# EasyEDA Pro project PM_proj.eprj

# Schematic Proiect

## Sheets
1 Unitate Centrala: Board Name: Board1; Create Date: 2025-11-04; Page Name: Unitate Centrala; Project Name: PM_proj; Schematic Name: Proiect; Update Date: 2025-11-04; Company: EasyEDA.com; Page Size: A4; Version: V1.0
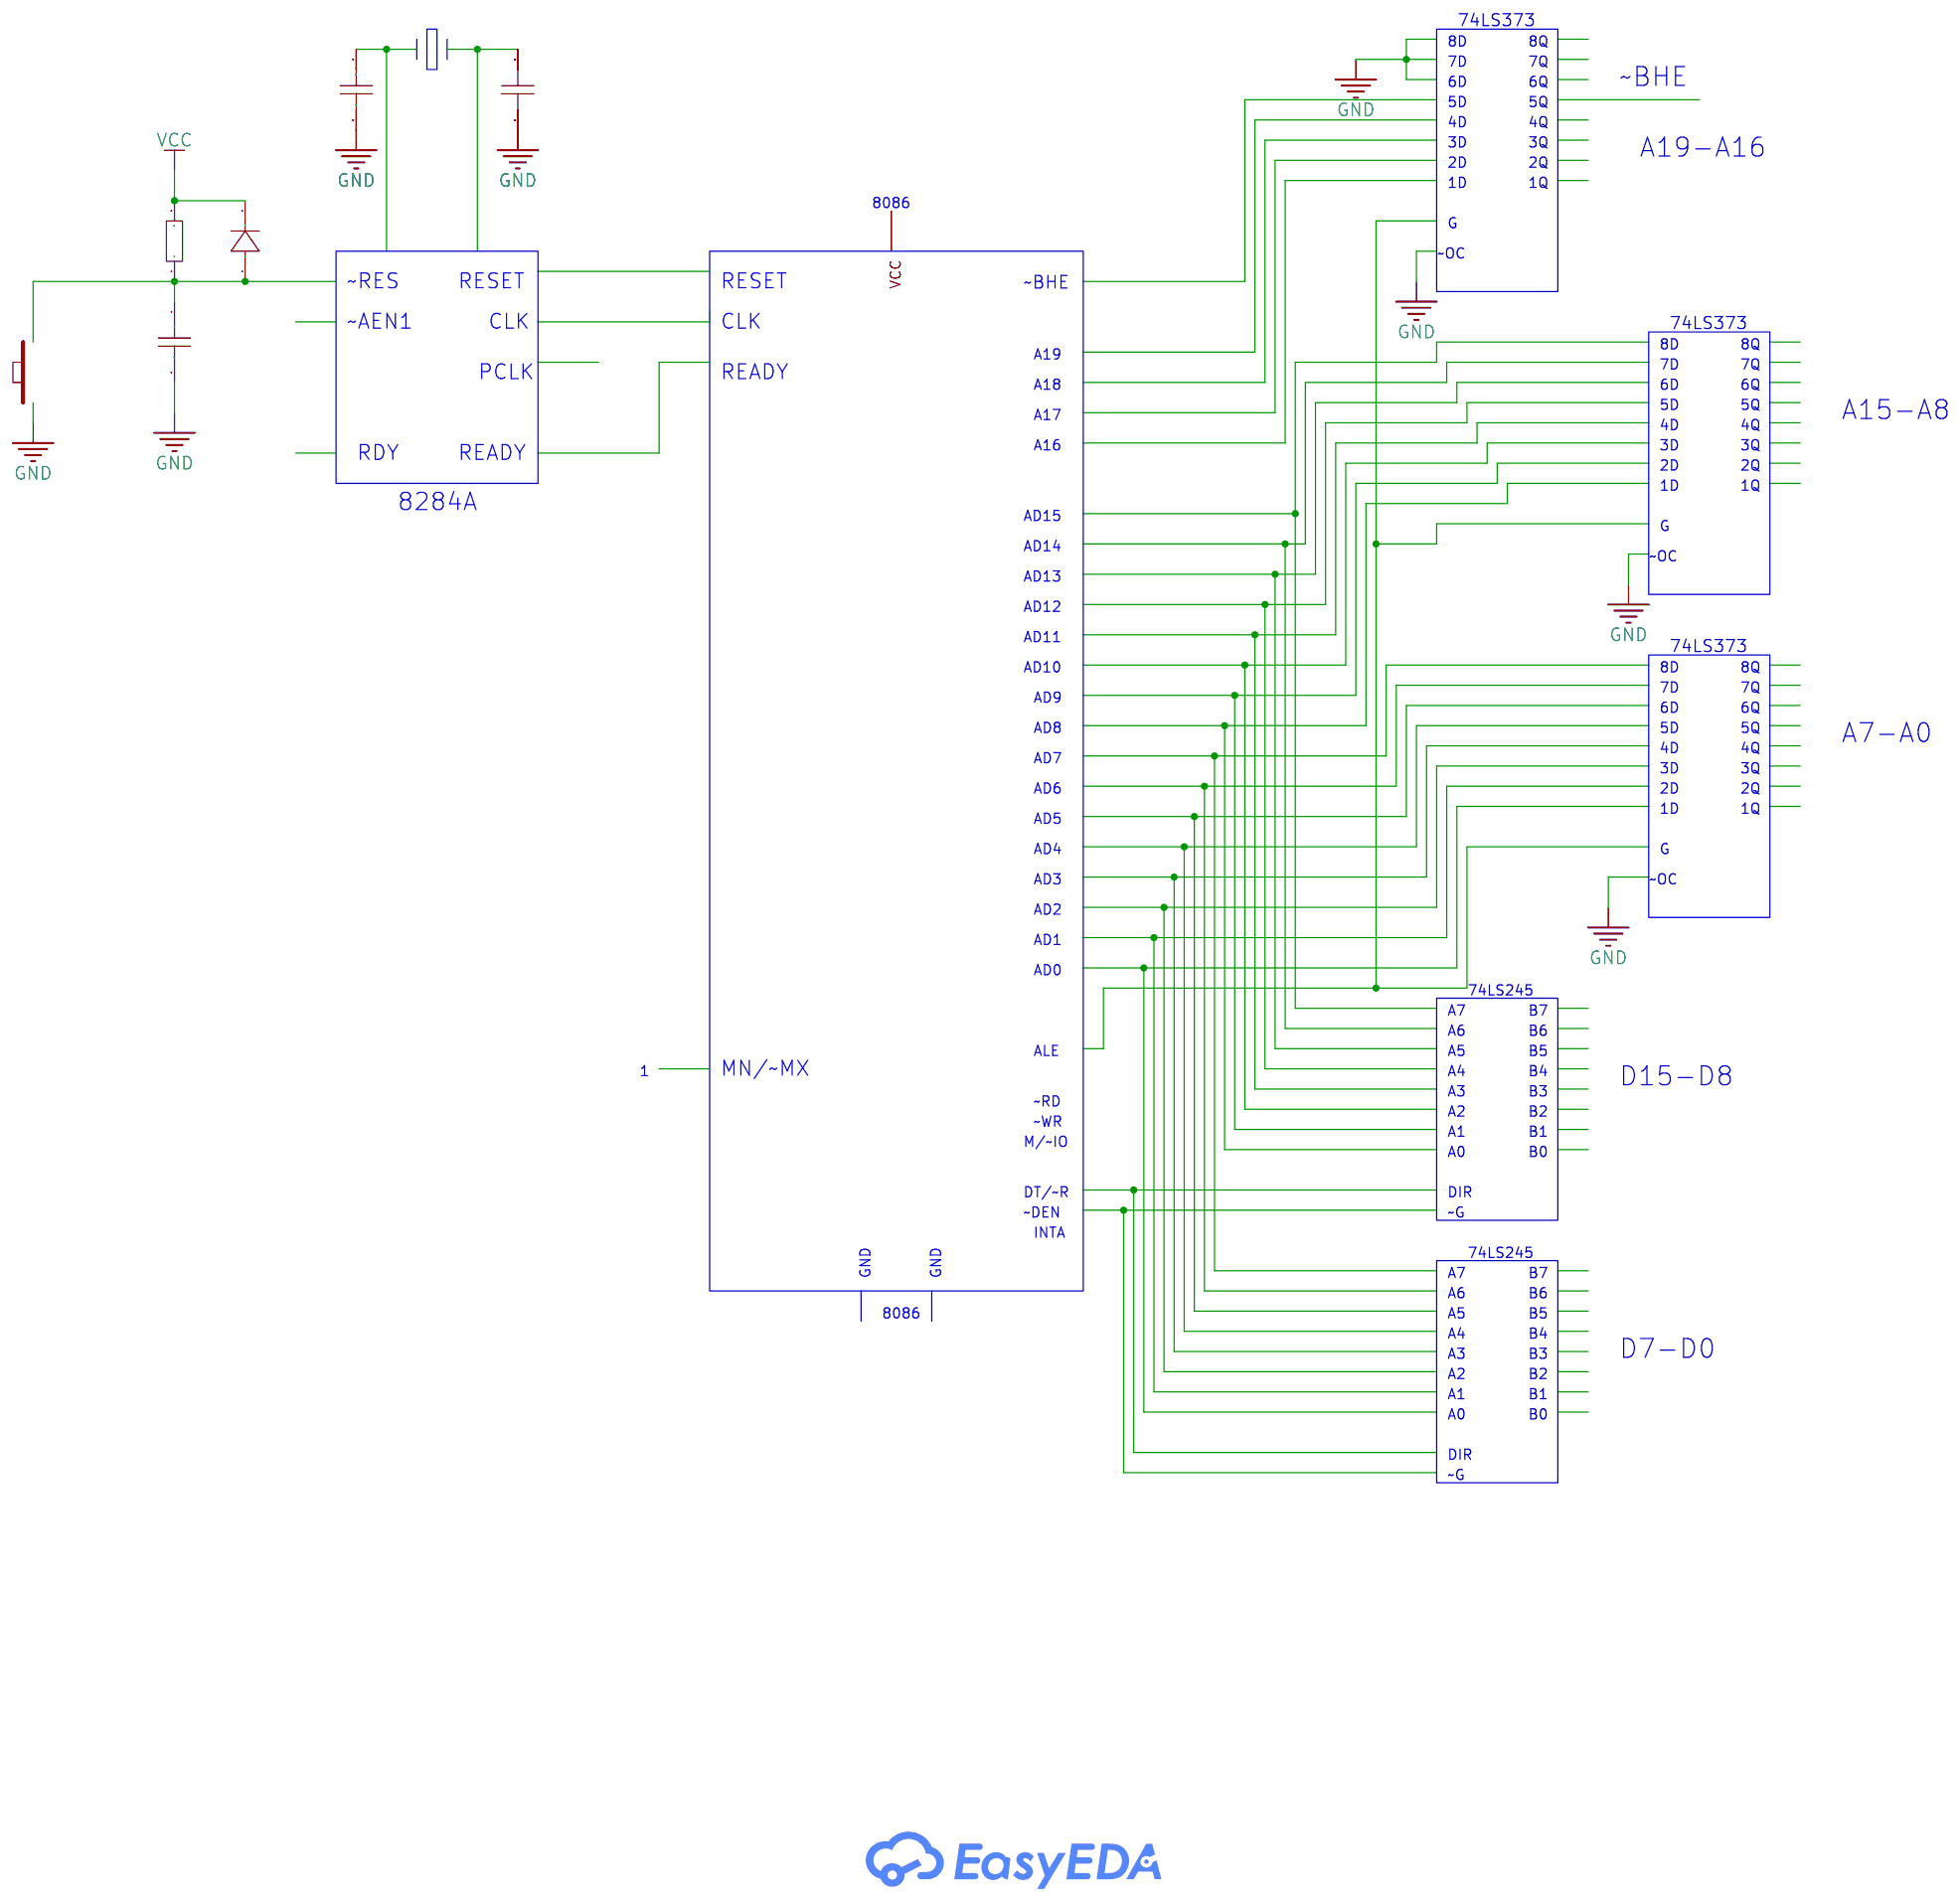
[diagram p0: Unitate Centrala]
2 2. Conectarea Mem: Create Date: 2025-11-11; Page Name: 2. Conectarea Mem; Update Date: 2025-11-12
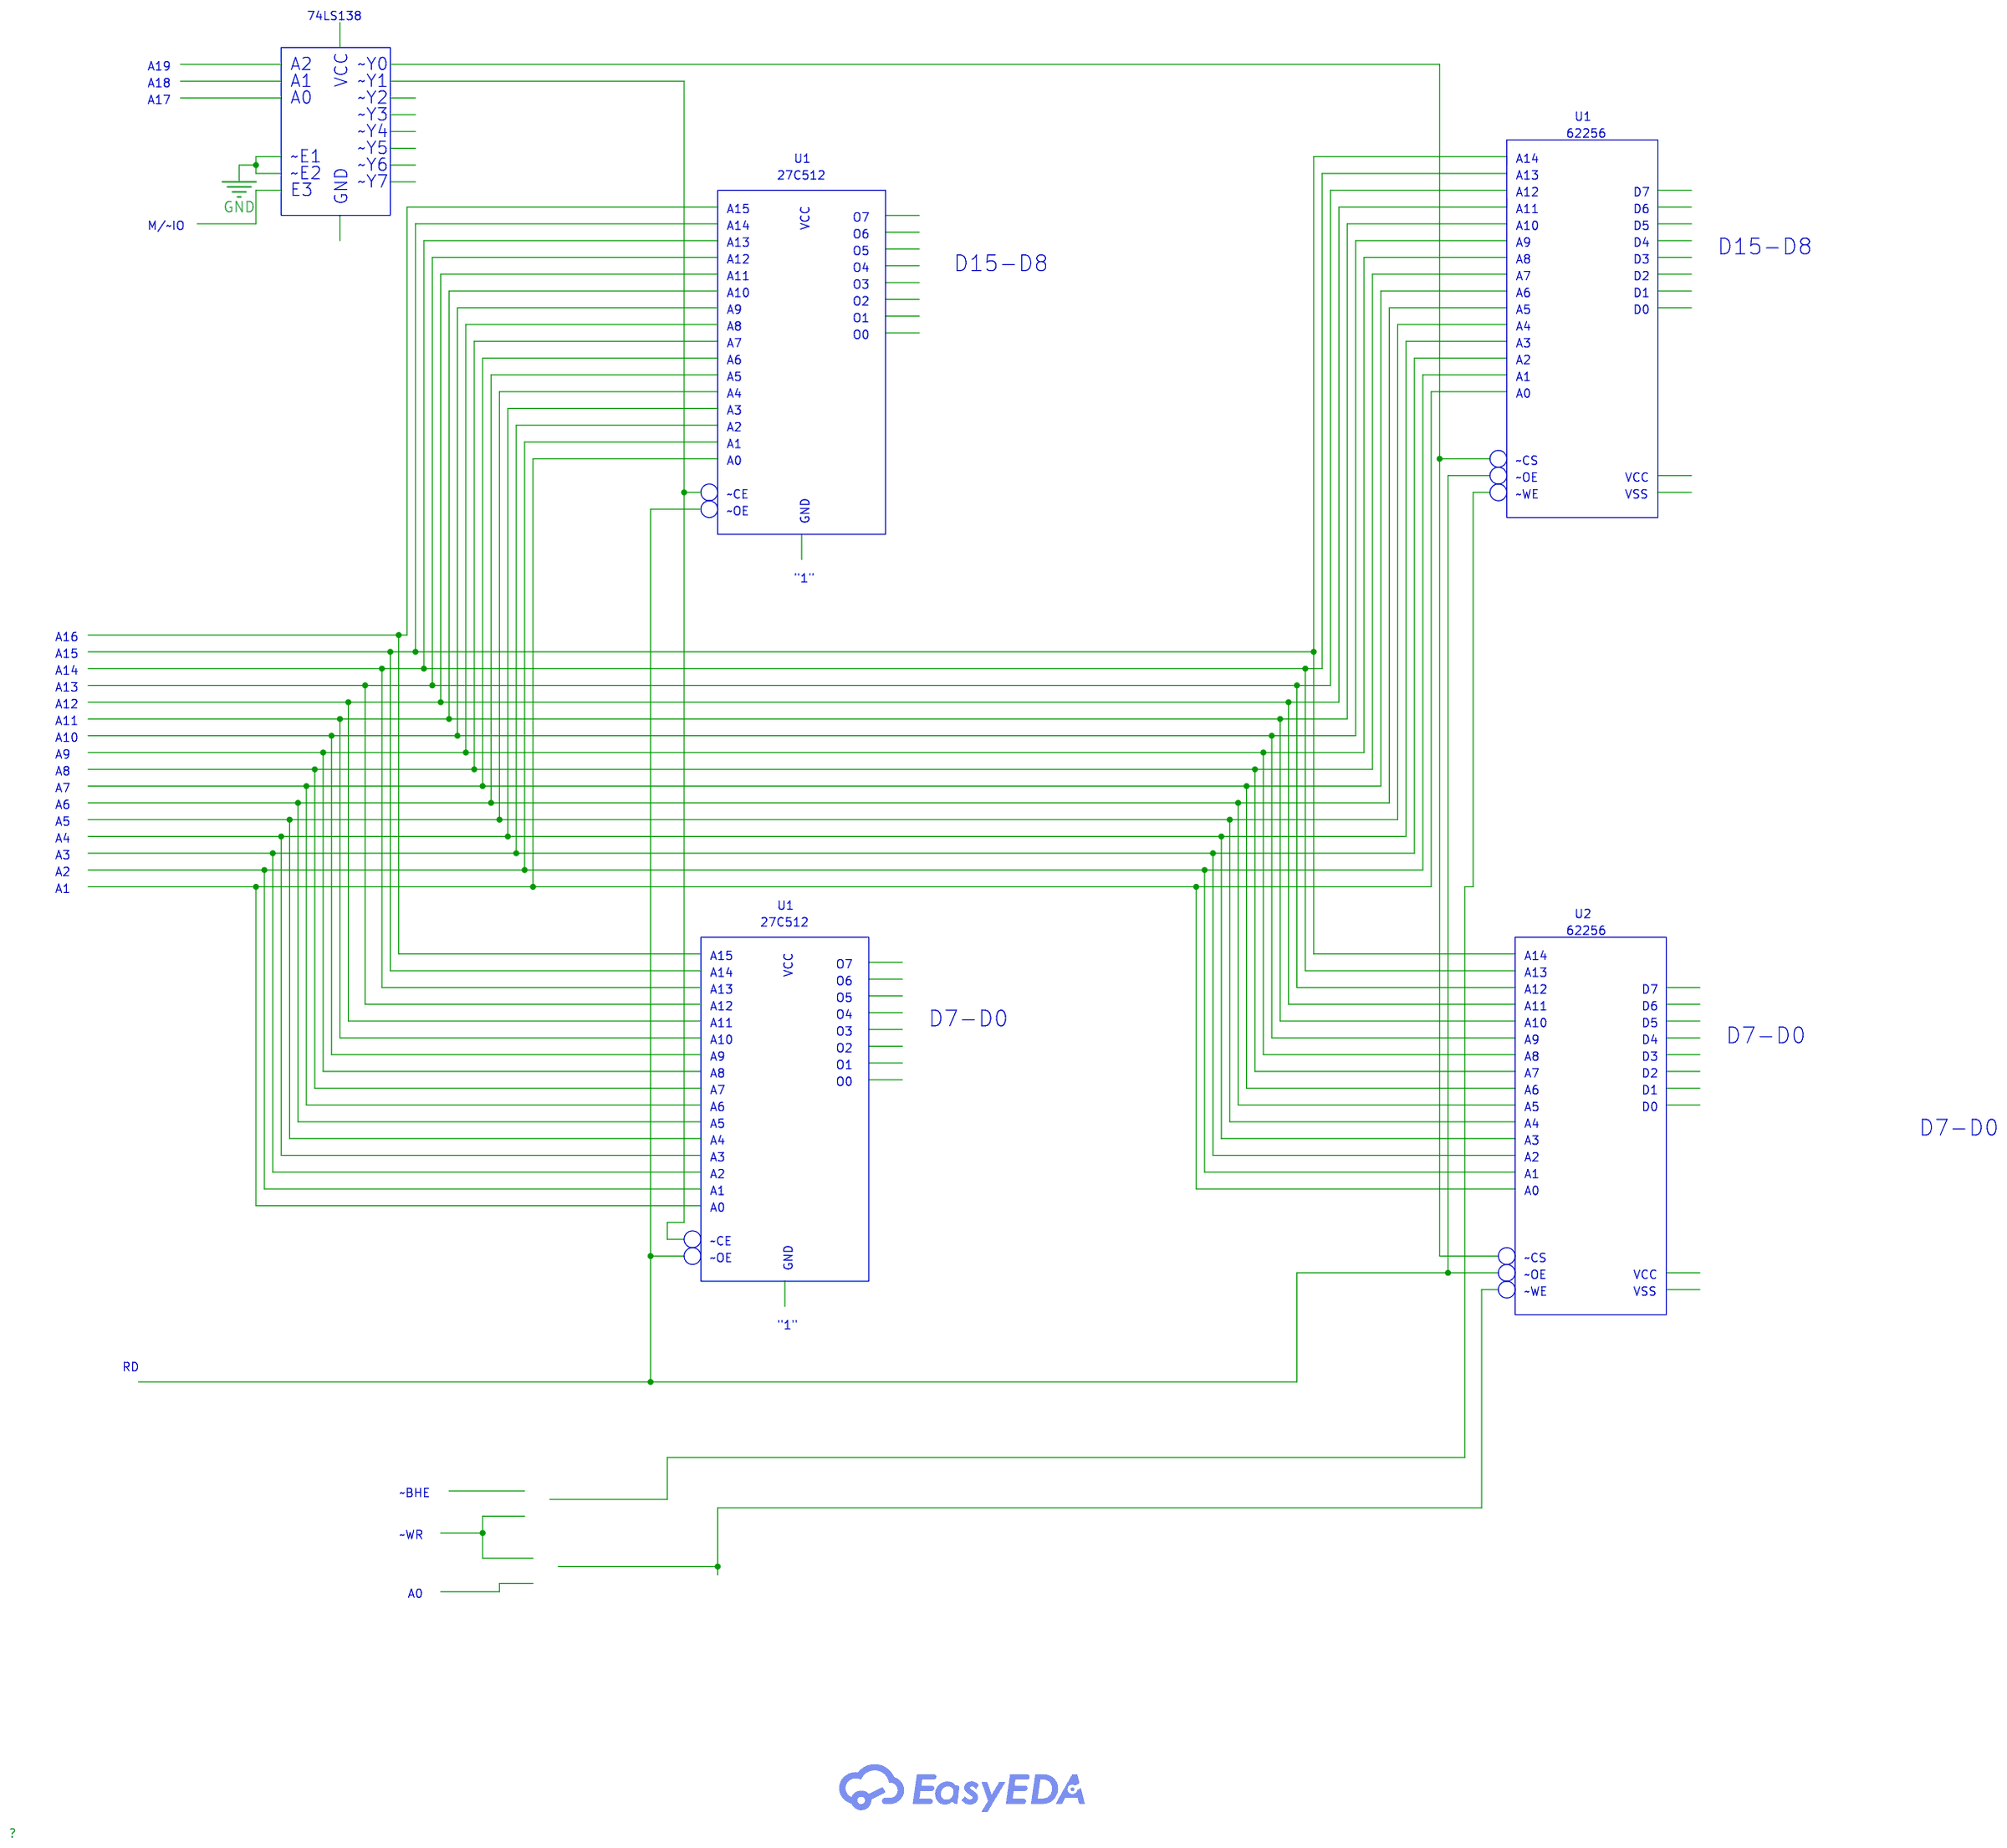
[diagram p1: 2. Conectarea Mem]
3 Decodificarea Porturilor: Create Date: 2025-11-12; Page Name: Decodificarea Porturilor; Update Date: 2025-11-12
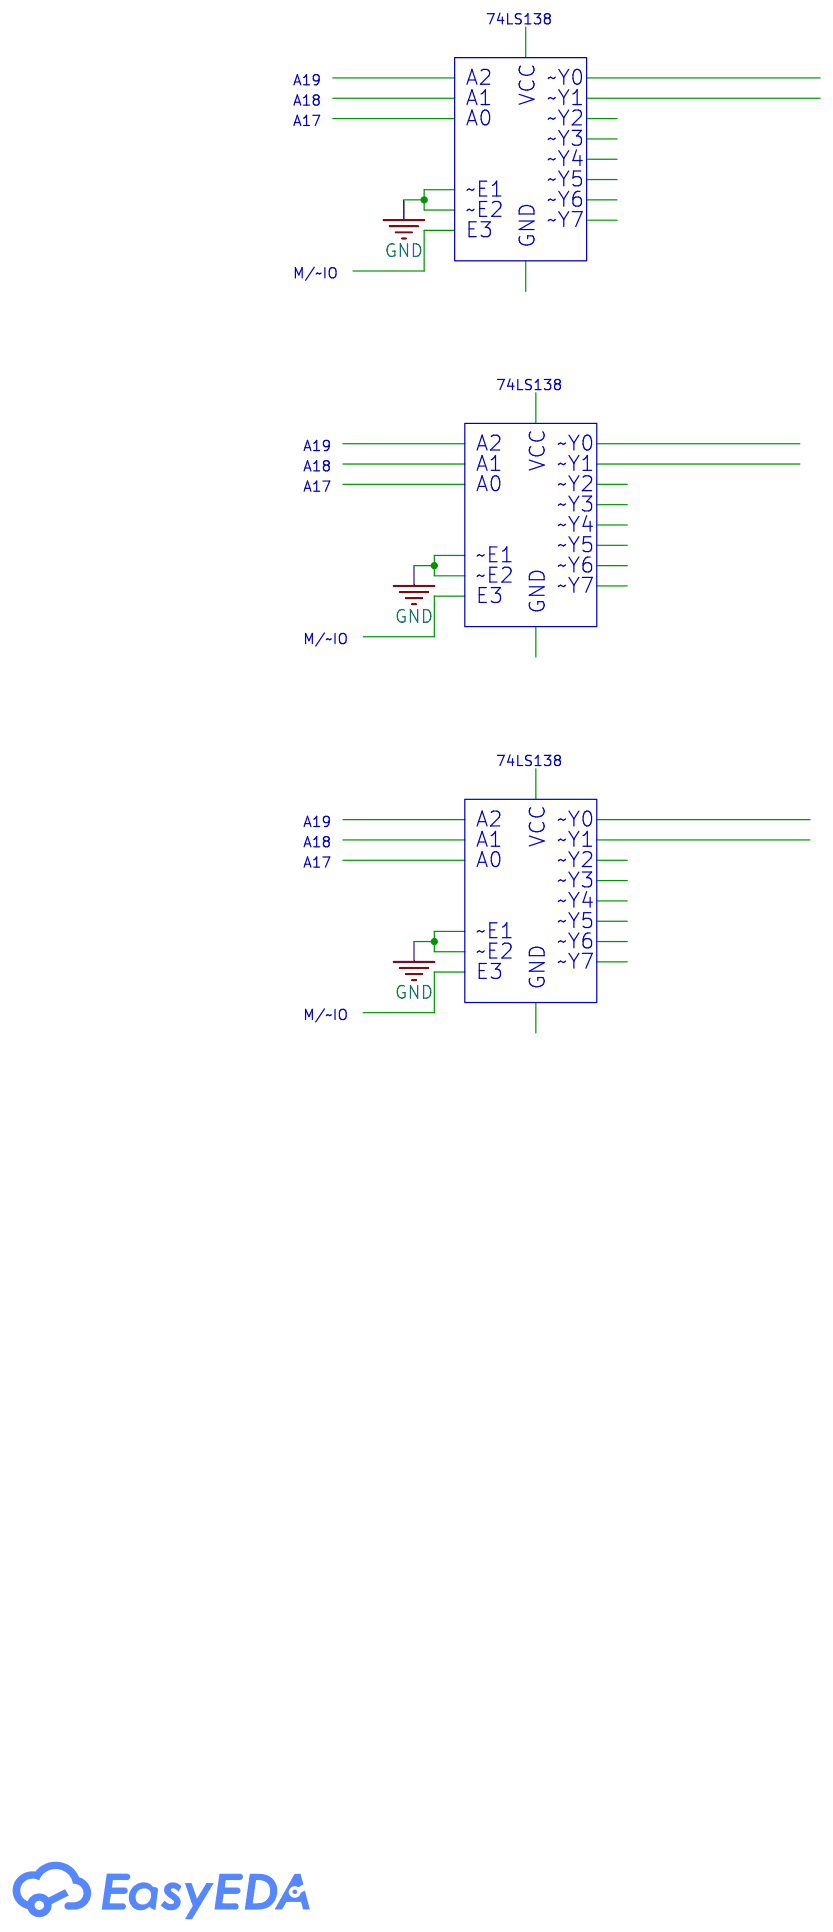
[diagram p2: Decodificarea Porturilor]

## Parts
C1  100nF  [C0603]
C2  100nF  [C0603]
C3  100nF  [C0603]
D1  -  [SMA_L4.4-W2.8-LS5.4-RD]
R1  10K  [R0603]

## Library data of the parts
C1-C3 = CAP_0603: Supplier Footprint: 0603
D1 = 1N4007: Supplier Footprint: SMA(DO-214AC); Supplier Part: C727081
R1 = Res_0603: Supplier Footprint: 0603

## Nets
GND: C1.2 C2.2 C3.2
VCC: D1.1(K) R1.2
Net-(C1-1): C1.1 D1.2(A) R1.1

Not connected (* = marked no-connect by the designer): C2 1; C3 1

## Notes on the sheets
sheet 1
- 74LS373
- 8D
- 8Q
- 6D
- 7D
- 6Q
- 7Q
- ~BHE
- 5D
- 5Q
- 4D
- 4Q
- 3D
- 3Q
- A19-A16
- 2D
- 2Q
- 8086
- 1D
- 1Q
- G
- ~OC
- ~RES
- RESET
- RESET
- VCC
- ~BHE
- ~AEN1
- CLK
- CLK
- 8D
- 74LS373
- 8Q
- A19
- 7D
- 7Q
- PCLK
- READY
- A18
- 6D
- 6Q
- A17
- 5D
- 5Q
- A15-A8
- 4D
- 4Q
- RDY
- READY
- A16
- 2D
- 3D
- 2Q
- 3Q
- 1D
- 1Q
- 8284A
- AD15
- G
- AD14
- ~OC
- AD13
- AD12
- AD11
- 74LS373
- AD10
- 8D
- 8Q
- AD9
- 7D
- 7Q
- AD8
- 5D
- 6D
- 5Q
- 6Q
- 4D
- 4Q
- A7-A0
- AD7
- 3D
- 3Q
- AD6
- 2D
- 2Q
- AD5
- 1D
- 1Q
- AD4
- G
- AD3
- ~OC
- AD2
- AD1
- AD0
- 74LS245
- A7
- B7
- A6
- B6
- ALE
- A5
- B5
- 1
- MN/~MX
- A4
- B4
- D15-D8
- ~RD
- A3
- B3
- ~WR
- A1
- A2
- B1
- B2
- M/~IO
- A0
- B0
- DT/~R
- DIR
- ~DEN
- ~G
- INTA
- 74LS245
- GND
- GND
- A7
- B7
- A6
- B6
- 8086
- A5
- B5
- A4
- B4
- A3
- B3
- D7-D0
- A1
- A2
- B1
- B2
- A0
- B0
- DIR
- ~G
sheet 2
- 74LS138
- A19
- A2
- ~Y0
- A18
- A1
- VCC
- ~Y1
- A17
- A0
- ~Y2
- ~Y3
- ~Y4
- 62256
- U1
- ~Y5
- ~E1
- ~E2
- ~Y6
- 27C512
- U1
- A13
- A14
- E3
- ~Y7
- A12
- D7
- GND
- A15
- A11
- D6
- M/~IO
- A14
- VCC
- O6
- O7
- A10
- D5
- A13
- O5
- A9
- D4
- D15-D8
- A12
- O4
- D15-D8
- A8
- D3
- A10
- A11
- O3
- A6
- A7
- D1
- D2
- A9
- O2
- A5
- D0
- A8
- O1
- A4
- A7
- O0
- A3
- A6
- A2
- A4
- A5
- A0
- A1
- A3
- A2
- A1
- A0
- ~CS
- ~OE
- VCC
- ~CE
- ~OE
- ~WE
- VSS
- GND
- "1"
- A16
- A14
- A15
- A13
- A12
- A11
- A10
- A9
- A7
- A8
- A6
- A5
- A4
- A3
- A1
- A2
- U1
- 27C512
- U2
- 62256
- A15
- O7
- A14
- A14
- VCC
- O6
- A13
- A12
- A13
- O5
- A11
- A12
- D6
- D7
- A11
- O4
- D7-D0
- A10
- D5
- A10
- O2
- O3
- A9
- D4
- D7-D0
- A9
- O1
- A8
- D3
- A8
- O0
- A7
- D2
- A6
- A7
- A5
- A6
- D0
- D1
- A5
- A4
- A4
- A3
- D7-D0
- A3
- A2
- A2
- A1
- A1
- A0
- A0
- ~CE
- ~OE
- ~CS
- GND
- ~OE
- VCC
- ~WE
- VSS
- "1"
- RD
- ~BHE
- ~WR
- A0
sheet 3
- 74LS138
- A19
- A2
- ~Y0
- A18
- A1
- VCC
- ~Y1
- A17
- A0
- ~Y2
- ~Y3
- ~Y4
- ~Y5
- ~E1
- ~E2
- ~Y6
- E3
- ~Y7
- GND
- M/~IO
- 74LS138
- A19
- A2
- ~Y0
- A18
- A1
- VCC
- ~Y1
- A17
- A0
- ~Y2
- ~Y3
- ~Y4
- ~Y5
- ~E1
- ~Y6
- ~E2
- ~Y7
- E3
- GND
- M/~IO
- 74LS138
- A19
- A2
- ~Y0
- A18
- A1
- VCC
- ~Y1
- A17
- A0
- ~Y2
- ~Y3
- ~Y4
- ~Y5
- ~E1
- ~E2
- ~Y6
- E3
- ~Y7
- GND
- M/~IO
